# Altium schematic sheet Shift Registers.SchDoc
size A4; SheetNumber: 4; SheetTotal: 4
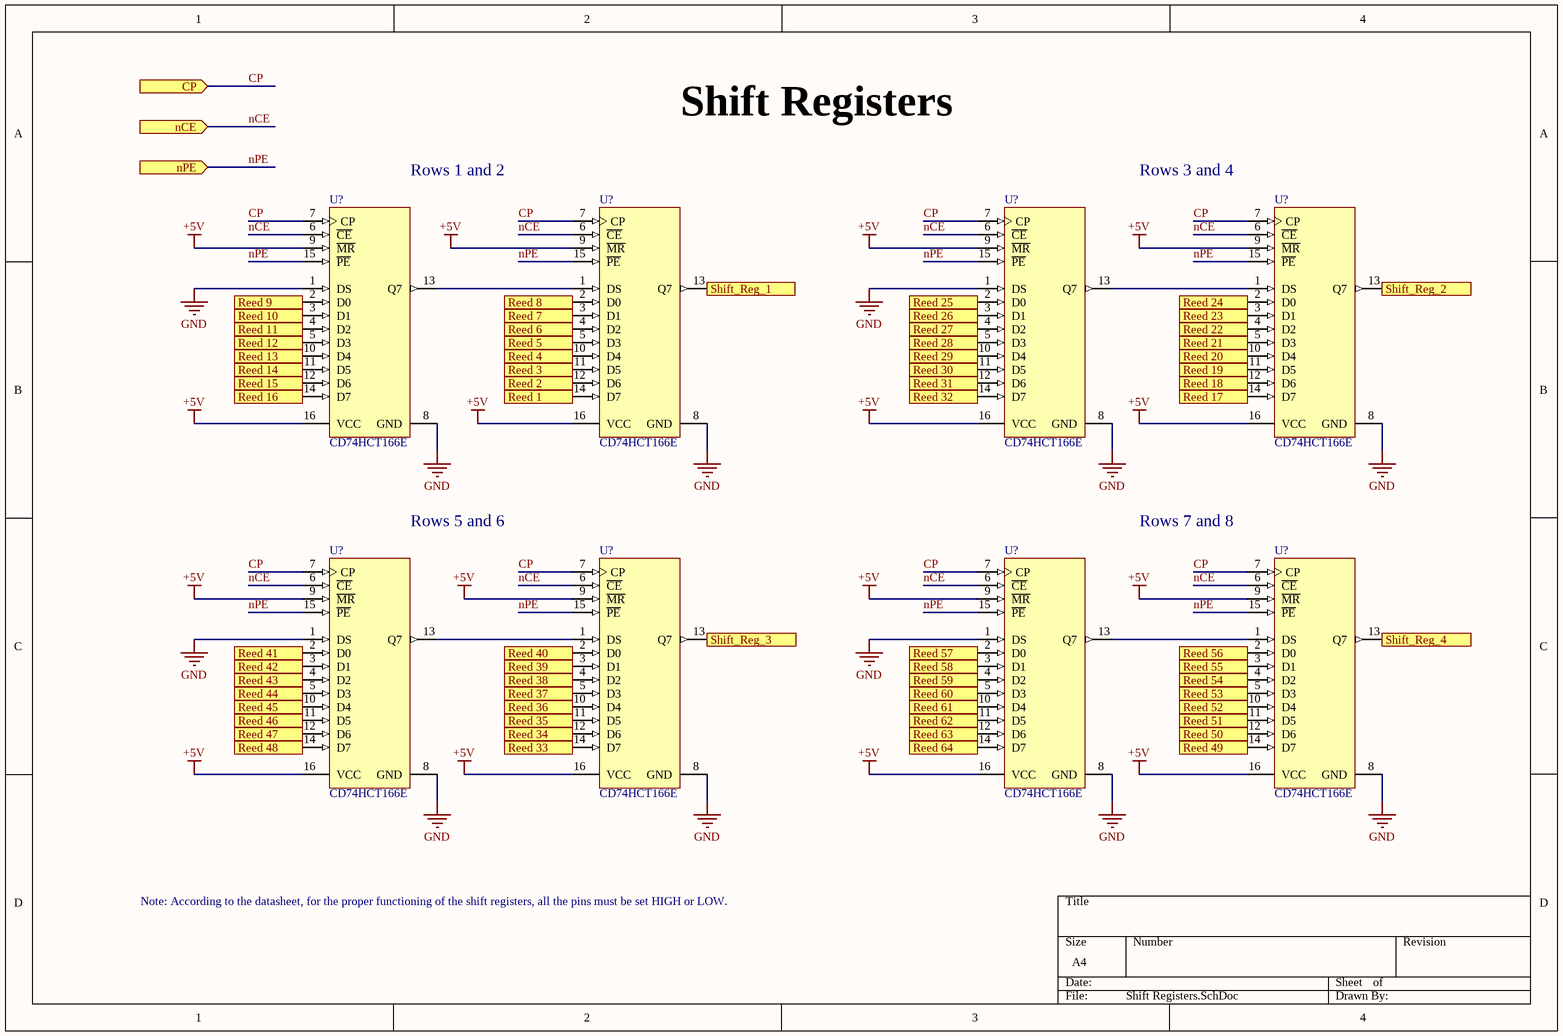
[diagram p0: Shift Registers.SchDoc]

## Parts
(Parts that share a designator on the sheet are numbered #1, #2 ... from top to bottom, then left to right.)
U?#1  CD74HCT166E  [N0016A]
U?#2  CD74HCT166E  [N0016A]
U?#3  CD74HCT166E  [N0016A]
U?#4  CD74HCT166E  [N0016A]
U?#5  CD74HCT166E  [N0016A]
U?#6  CD74HCT166E  [N0016A]
U?#7  CD74HCT166E  [N0016A]
U?#8  CD74HCT166E  [N0016A]

## Ports
CP (in), nCE (in), nPE (in), Reed 1 (in, see Reed Switches[1A]), Reed 2 (in, see Reed Switches[2A]), Reed 3 (in, see Reed Switches[3A]), Reed 4 (in, see Reed Switches[4A]), Reed 5 (in, see Reed Switches[5A]), Reed 6 (in, see Reed Switches[5A]), Reed 7 (in, see Reed Switches[6A]), Reed 8 (in, see Reed Switches[7A]), Reed 9 (in, see Reed Switches[1B]), Reed 10 (in, see Reed Switches[2B]), Reed 11 (in, see Reed Switches[3B]), Reed 12 (in, see Reed Switches[4B]), Reed 13 (in, see Reed Switches[5B]), Reed 14 (in, see Reed Switches[5B]), Reed 15 (in, see Reed Switches[6B]), Reed 16 (in, see Reed Switches[7B]), Reed 17 (in, see Reed Switches[1B]), Reed 18 (in, see Reed Switches[2B]), Reed 19 (in, see Reed Switches[3B]), Reed 20 (in, see Reed Switches[4B]), Reed 21 (in, see Reed Switches[5B]), Reed 22 (in, see Reed Switches[5B]), Reed 23 (in, see Reed Switches[6B]), Reed 24 (in, see Reed Switches[7B]), Reed 25 (in, see Reed Switches[1B]), Reed 26 (in, see Reed Switches[2B]), Reed 27 (in, see Reed Switches[3B]), Reed 28 (in, see Reed Switches[4B]), Reed 29 (in, see Reed Switches[5B]), Reed 30 (in, see Reed Switches[5B]), Reed 31 (in, see Reed Switches[6B]), Reed 32 (in, see Reed Switches[7B]), Reed 33 (in, see Reed Switches[1C]), Reed 34 (in, see Reed Switches[2C]), Reed 35 (in, see Reed Switches[3C]), Reed 36 (in, see Reed Switches[4C]), Reed 37 (in, see Reed Switches[5C]), Reed 38 (in, see Reed Switches[5C]), Reed 39 (in, see Reed Switches[6C]), Reed 40 (in, see Reed Switches[7C]), Reed 41 (in, see Reed Switches[1C]), Reed 42 (in, see Reed Switches[2C]), Reed 43 (in, see Reed Switches[3C]), Reed 44 (in, see Reed Switches[4C]), Reed 45 (in, see Reed Switches[5C]), Reed 46 (in, see Reed Switches[5C]), Reed 47 (in, see Reed Switches[6C]), Reed 48 (in, see Reed Switches[7C]), Reed 49 (in, see Reed Switches[1C]), Reed 50 (in, see Reed Switches[2C]), Reed 51 (in, see Reed Switches[3C]), Reed 52 (in, see Reed Switches[4C]), Reed 53 (in, see Reed Switches[5C]), Reed 54 (in, see Reed Switches[5C]), Reed 55 (in, see Reed Switches[6C]), Reed 56 (in, see Reed Switches[7C]), Reed 57 (in, see Reed Switches[1D]), Reed 58 (in, see Reed Switches[2D]), Reed 59 (in, see Reed Switches[3D]), Reed 60 (in, see Reed Switches[4D]), Reed 61 (in, see Reed Switches[5D]), Reed 62 (in, see Reed Switches[5D]), Reed 63 (in, see Reed Switches[6D]), Reed 64 (in, see Reed Switches[7D]), Shift_Reg_1 (out), Shift_Reg_2 (out), Shift_Reg_3 (out), Shift_Reg_4 (out)

## Nets
+5V: U?#1.9(~{MR}) U?#1.16(VCC) U?#2.9(~{MR}) U?#2.16(VCC) U?#3.9(~{MR}) U?#3.16(VCC) U?#4.9(~{MR}) U?#4.16(VCC) U?#5.9(~{MR}) U?#5.16(VCC) U?#6.9(~{MR}) U?#6.16(VCC) U?#7.9(~{MR}) U?#7.16(VCC) U?#8.9(~{MR}) U?#8.16(VCC)
GND: U?#1.1(DS) U?#1.8(GND) U?#2.8(GND) U?#3.1(DS) U?#3.8(GND) U?#4.8(GND) U?#5.1(DS) U?#5.8(GND) U?#6.8(GND) U?#7.1(DS) U?#7.8(GND) U?#8.8(GND)
CP: U?#1.7(CP) U?#2.7(CP) U?#3.7(CP) U?#4.7(CP) U?#5.7(CP) U?#6.7(CP) U?#7.7(CP) U?#8.7(CP) ; port CP
nCE: U?#1.6(~{CE}) U?#2.6(~{CE}) U?#3.6(~{CE}) U?#4.6(~{CE}) U?#5.6(~{CE}) U?#6.6(~{CE}) U?#7.6(~{CE}) U?#8.6(~{CE}) ; port nCE
nPE: U?#1.15(~{PE}) U?#2.15(~{PE}) U?#3.15(~{PE}) U?#4.15(~{PE}) U?#5.15(~{PE}) U?#6.15(~{PE}) U?#7.15(~{PE}) U?#8.15(~{PE}) ; port nPE
Reed 1: U?#2.14(D7) ; port Reed 1
Reed 2: U?#2.12(D6) ; port Reed 2
Reed 3: U?#2.11(D5) ; port Reed 3
Reed 4: U?#2.10(D4) ; port Reed 4
Reed 5: U?#2.5(D3) ; port Reed 5
Reed 6: U?#2.4(D2) ; port Reed 6
Reed 7: U?#2.3(D1) ; port Reed 7
Reed 8: U?#2.2(D0) ; port Reed 8
Reed 9: U?#1.2(D0) ; port Reed 9
Reed 10: U?#1.3(D1) ; port Reed 10
Reed 11: U?#1.4(D2) ; port Reed 11
Reed 12: U?#1.5(D3) ; port Reed 12
Reed 13: U?#1.10(D4) ; port Reed 13
Reed 14: U?#1.11(D5) ; port Reed 14
Reed 15: U?#1.12(D6) ; port Reed 15
Reed 16: U?#1.14(D7) ; port Reed 16
Reed 17: U?#4.14(D7) ; port Reed 17
Reed 18: U?#4.12(D6) ; port Reed 18
Reed 19: U?#4.11(D5) ; port Reed 19
Reed 20: U?#4.10(D4) ; port Reed 20
Reed 21: U?#4.5(D3) ; port Reed 21
Reed 22: U?#4.4(D2) ; port Reed 22
Reed 23: U?#4.3(D1) ; port Reed 23
Reed 24: U?#4.2(D0) ; port Reed 24
Reed 25: U?#3.2(D0) ; port Reed 25
Reed 26: U?#3.3(D1) ; port Reed 26
Reed 27: U?#3.4(D2) ; port Reed 27
Reed 28: U?#3.5(D3) ; port Reed 28
Reed 29: U?#3.10(D4) ; port Reed 29
Reed 30: U?#3.11(D5) ; port Reed 30
Reed 31: U?#3.12(D6) ; port Reed 31
Reed 32: U?#3.14(D7) ; port Reed 32
Reed 33: U?#6.14(D7) ; port Reed 33
Reed 34: U?#6.12(D6) ; port Reed 34
Reed 35: U?#6.11(D5) ; port Reed 35
Reed 36: U?#6.10(D4) ; port Reed 36
Reed 37: U?#6.5(D3) ; port Reed 37
Reed 38: U?#6.4(D2) ; port Reed 38
Reed 39: U?#6.3(D1) ; port Reed 39
Reed 40: U?#6.2(D0) ; port Reed 40
Reed 41: U?#5.2(D0) ; port Reed 41
Reed 42: U?#5.3(D1) ; port Reed 42
Reed 43: U?#5.4(D2) ; port Reed 43
Reed 44: U?#5.5(D3) ; port Reed 44
Reed 45: U?#5.10(D4) ; port Reed 45
Reed 46: U?#5.11(D5) ; port Reed 46
Reed 47: U?#5.12(D6) ; port Reed 47
Reed 48: U?#5.14(D7) ; port Reed 48
Reed 49: U?#8.14(D7) ; port Reed 49
Reed 50: U?#8.12(D6) ; port Reed 50
Reed 51: U?#8.11(D5) ; port Reed 51
Reed 52: U?#8.10(D4) ; port Reed 52
Reed 53: U?#8.5(D3) ; port Reed 53
Reed 54: U?#8.4(D2) ; port Reed 54
Reed 55: U?#8.3(D1) ; port Reed 55
Reed 56: U?#8.2(D0) ; port Reed 56
Reed 57: U?#7.2(D0) ; port Reed 57
Reed 58: U?#7.3(D1) ; port Reed 58
Reed 59: U?#7.4(D2) ; port Reed 59
Reed 60: U?#7.5(D3) ; port Reed 60
Reed 61: U?#7.10(D4) ; port Reed 61
Reed 62: U?#7.11(D5) ; port Reed 62
Reed 63: U?#7.12(D6) ; port Reed 63
Reed 64: U?#7.14(D7) ; port Reed 64
Shift_Reg_1: U?#2.13(Q7) ; port Shift_Reg_1
Shift_Reg_2: U?#4.13(Q7) ; port Shift_Reg_2
Shift_Reg_3: U?#6.13(Q7) ; port Shift_Reg_3
Shift_Reg_4: U?#8.13(Q7) ; port Shift_Reg_4
NetU?#1_13: U?#1.13(Q7) U?#2.1(DS)
NetU?#3_13: U?#3.13(Q7) U?#4.1(DS)
NetU?#5_13: U?#5.13(Q7) U?#6.1(DS)
NetU?#7_13: U?#7.13(Q7) U?#8.1(DS)

## Notes on the sheet
- (near U?#1) Rows 1 and 2
- Shift Registers
- (near U?#4) Rows 3 and 4
- (near U?#5) Rows 5 and 6
- (near U?#8) Rows 7 and 8
- Note: According to the datasheet, for the proper functioning of the shift registers, all the pins must be set HIGH or LOW.

## Library data of the parts
U?#1-U?#8 = CMP-0807-00166-3: High Speed CMOS Logic 8-Bit Parallel-In/Serial-Out Shift Register, N0016A, TUBE; Manufacturer: Texas Instruments; Voltage(Nom)(V): 5; Bits: 8; Output Drive (IOL/IOH)(Max)(mA): 4/-4; F @ Nom Voltage(Max)(Mhz): 25; VCC(Max)(V): 5.5; 3-State Output: No; VCC(Min)(V): 4.5; tpd @ Nom Voltage(Max)(ns): 50; Technology Family: HCT; Input Type: TTL; ICC @ Nom Voltage(Max)(mA): 0.08; Rating: Catalog; Operating Temperature Range(C): -55 to 125; PackageVersion: http://www.ti.com/lit/ml/mpdi002c/mpdi002c.pdf; DatasheetVersion: SCHS157C; Generic Part Number: CD74HCT166; PackageReference: N0016A; Code_JEDEC: MS-001; Output Type: CMOS